# Altium project ARMflash_revC.PrjPcb (part 4 of 4)

## Sheet Pg16_PSU.SchDoc: POWER SUPPLY
size A2; DrawnBy: RvS; DocumentNumber: 16; Revision: C2; SheetNumber: 16; SheetTotal: 16; DocumentName: Power Supply; ProjectName: ARMflash Mini
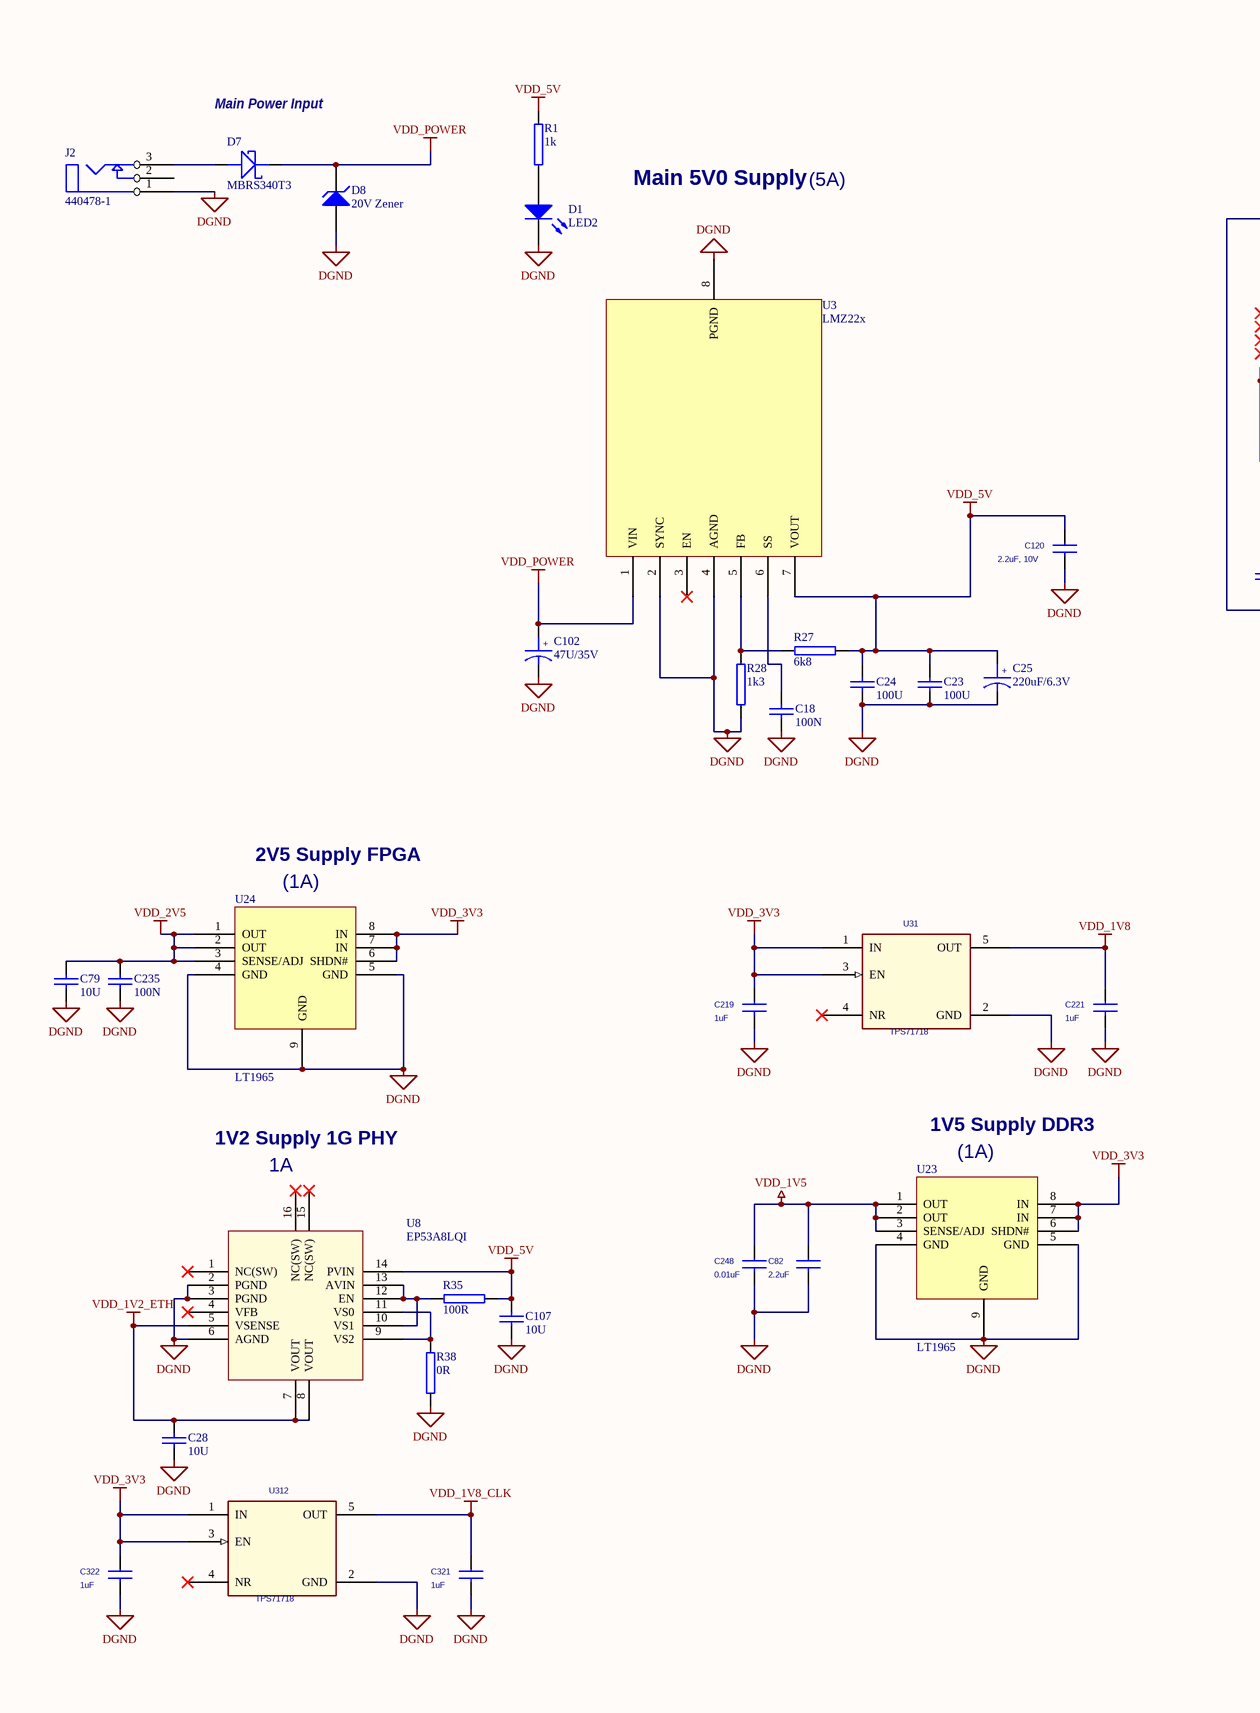
[diagram p19: Pg16_PSU.SchDoc, left]
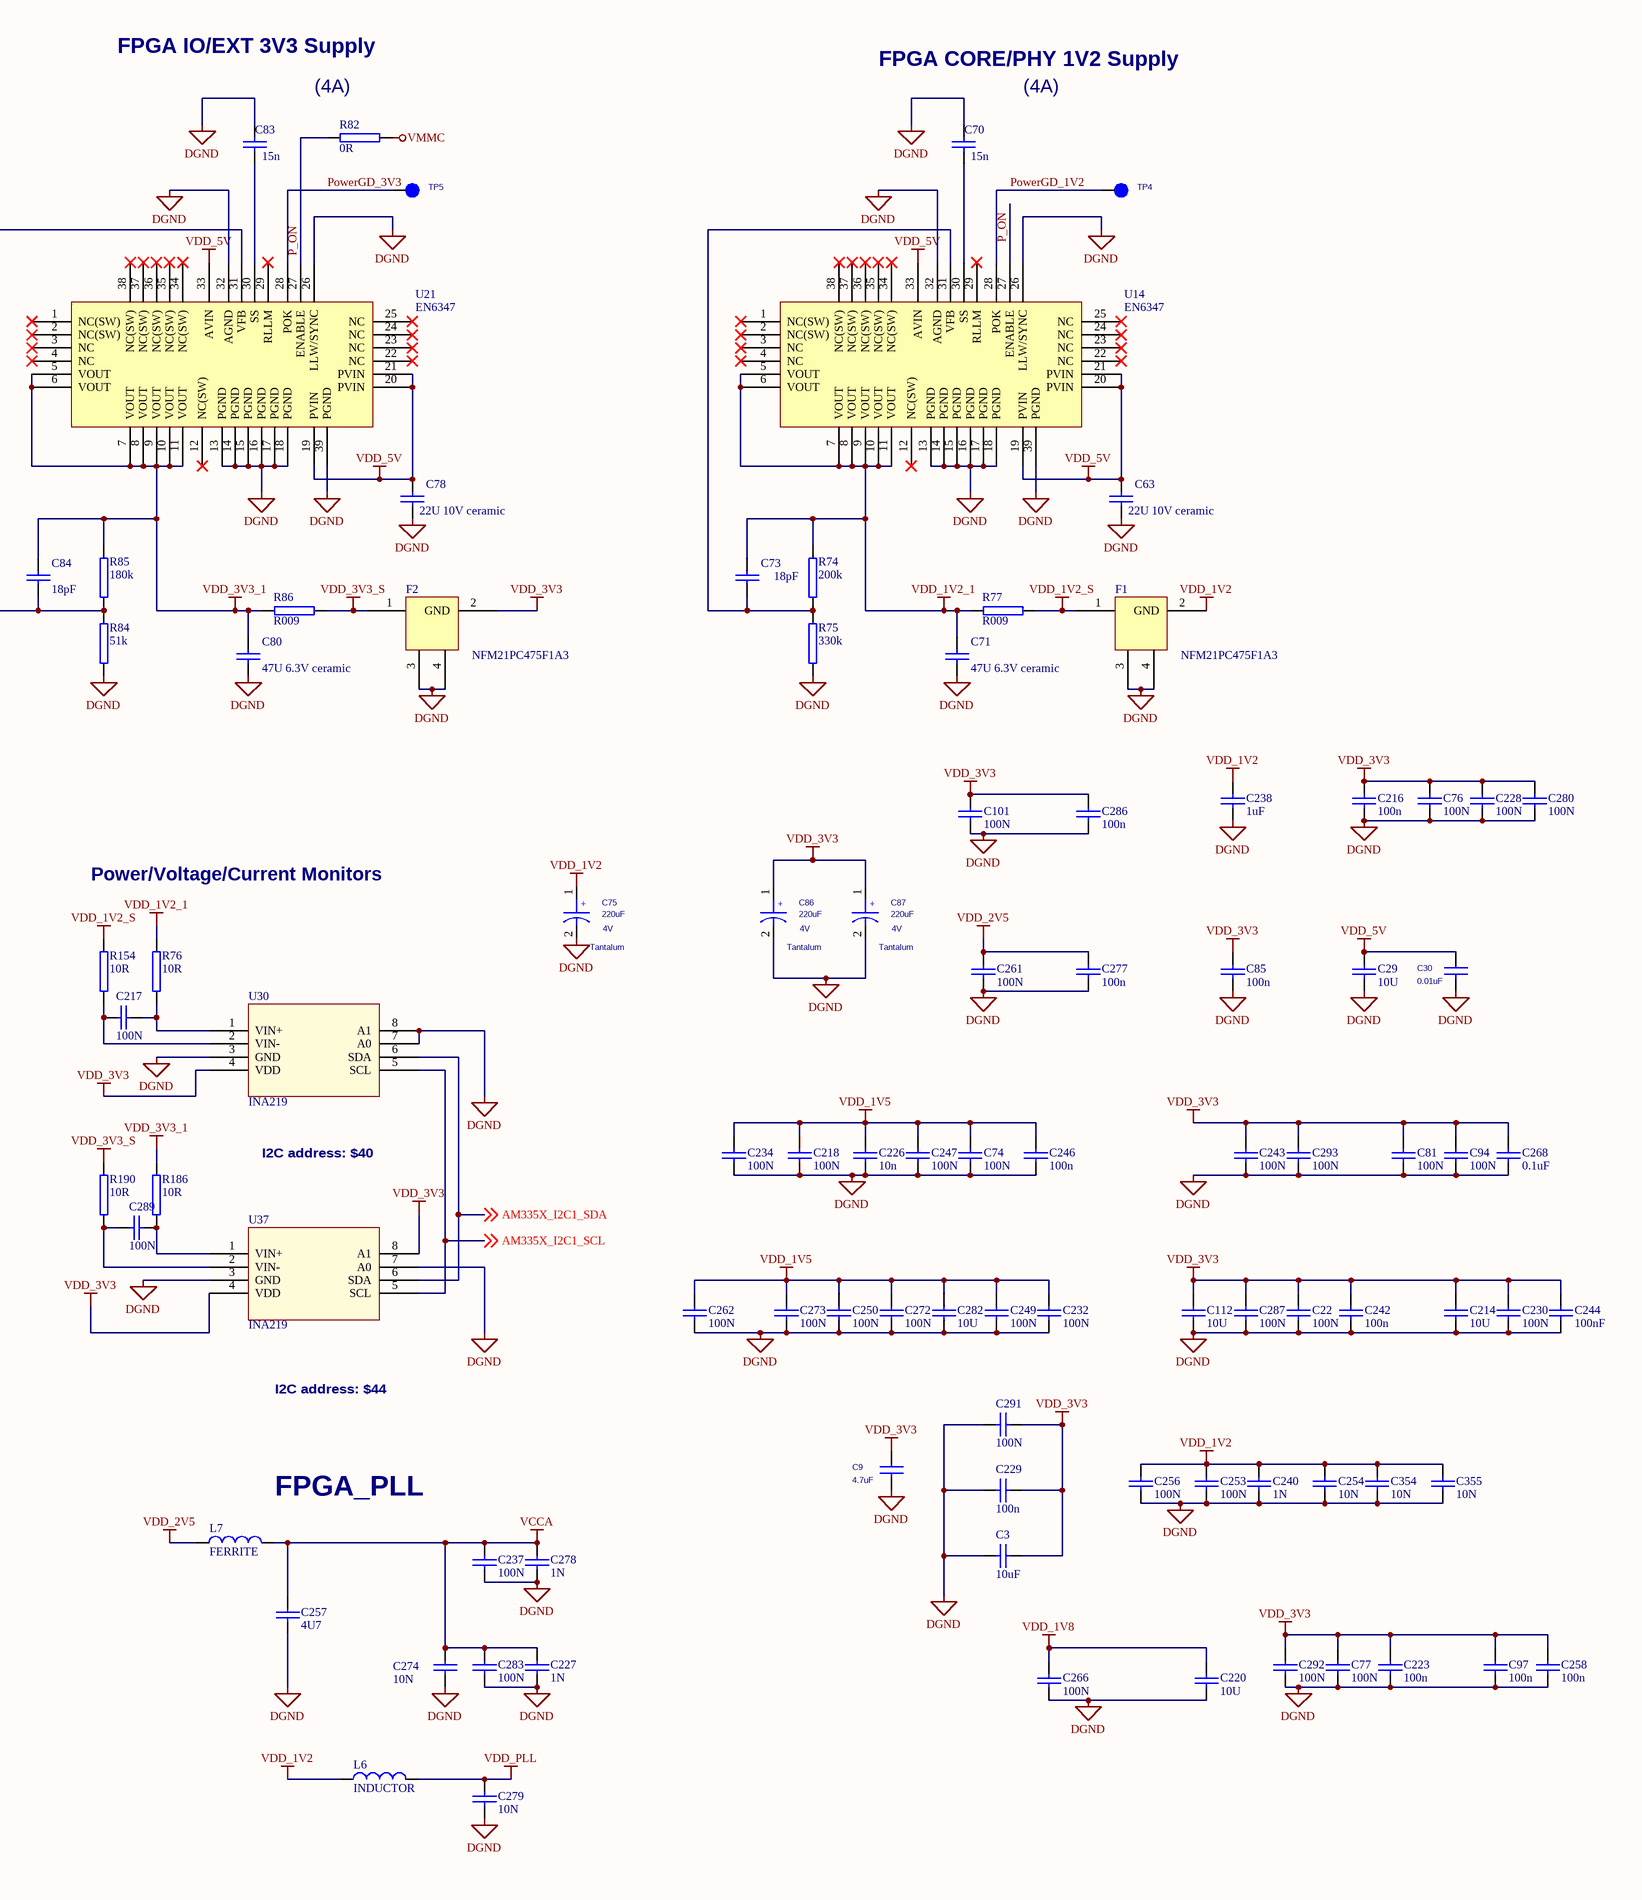
[diagram p20: Pg16_PSU.SchDoc, right]

### Parts
(Parts that share a designator on the sheet are numbered #1, #2 ... from top to bottom, then left to right.)
?#16  (no value)  (graphical)
C3  10uF  [SC0603]
C9  4.7uF  [SM-7351-CAP-0603]
C18  100N  [sc0402]
C22  100N  [0603]
C23  100U  [1206]
C24  100U  [1206]
C25  220uF/6.3V  [CASED]
C28  10U  [SC0603]
C29  10U  [0805]
C30  0.01uF  [SM-7351-CAP-0402]
C63  22U 10V ceramic  [1206]
C70  15n  [sc0402]
C71  47U 6.3V ceramic  [1206]
C73  18pF  [sc0402]
C74  100N  [0603]
C75  220uF  Working Voltage: 4V  Dielectric: Tantalum  [1210]
C76  100N  [sc0402]
C77  100N  [0603]
C78  22U 10V ceramic  [1206]
C79  10U  [sc0603]
C80  47U 6.3V ceramic  [1206]
C81  100N  [0603]
C82  2.2uF  [SM-7351-CAP-0805]
C83  15n  [sc0402]
C84  18pF  [sc0402]
C85  100n  [0603]
C86  220uF  Working Voltage: 4V  Dielectric: Tantalum  [1210]
C87  220uF  Working Voltage: 4V  Dielectric: Tantalum  [1210]
C94  100N  [0603]
C97  100n  [0603]
C101  100N  [0603]
C102  47U/35V  [CASED]
C107  10U  [SC0603]
C112  10U  [SC0603]
C120  2.2uF, 10V  [SM-7351-CAP-0402]
C214  10U  [0603]
C216  100n  [0603]
C217  100N  [sc0402]
C218  100N  [0603]
C219  1uF  [SM-7351-CAP-0402]
C220  10U  [sc0603]
C221  1uF  [SM-7351-CAP-0402]
C223  100n  [0603]
C226  10n  [0603]
C227  1N  [sc0402]
C228  100N  [0603]
C229  100n  [0603]
C230  100N  [0603]
C232  100N  [0603]
C234  100N  [SM-7351-CAP-0402]
C235  100N  [sc0402]
C237  100N  [sc0402]
C238  1uF  [sc0402]
C240  1N  [SM-7351-CAP-0402]
C242  100n  [0603]
C243  100N  [0603]
C244  100nF  [0603]
C246  100n  [SM-7351-CAP-0402]
C247  100N  [SM-7351-CAP-0402]
C248  0.01uF  [SM-7351-CAP-0402]
C249  100N  [0603]
C250  100N  [0603]
C253  100N  [SM-7351-CAP-0402]
C254  10N  [SM-7351-CAP-0402]
C256  100N  [SM-7351-CAP-0402]
C257  4U7  [0603]
C258  100n  [0603]
C261  100N  [sc0402]
C262  100N  [sc0402]
C266  100N  [sc0402]
C268  0.1uF  [sc0402]
C272  100N  [0603]
C273  100N  [sc0402]
C274  10N  [SC0603]
C277  100n  [0603]
C278  1N  [sc0402]
C279  10N  [SM-7351-CAP-0402]
C280  100N  [0603]
C282  10U  [sc0603]
C283  100N  [sc0402]
C286  100n  [0603]
C287  100N  [0603]
C289  100N  [sc0402]
C291  100N  [sc0402]
C292  100N  [0603]
C293  100N  [0603]
C321  1uF  [SM-7351-CAP-0402]
C322  1uF  [SM-7351-CAP-0402]
C354  10N  [SM-7351-CAP-0402]
C355  10N  [SM-7351-CAP-0402]
D1  LED2  [0603]
D7  MBRS340T3  [SMC]
D8  20V Zener  [SMB]
F1  NFM21PC475F1A3  [EM chip filter 0805]
F2  NFM21PC475F1A3  [EM chip filter 0805]
J2  440478-1  [CON_POWER]
L6  INDUCTOR  [sc0603]
L7  FERRITE  [SC0603]
R1  1k  [0603]
R27  6k8  [sc0402]
R28  1k3  [sc0402]
R35  100R  [sc0402]
R38  0R  [sc0402]
R74  200k  [sc0402]
R75  330k  [sc0402]
R76  10R  [sc0402]
R77  R009  [1206]
R82  0R  [sc0402]
R84  51k  [sc0402]
R85  180k  [sc0402]
R86  R009  [1206]
R154  10R  [sc0402]
R186  10R  [sc0402]
R190  10R  [sc0402]
TP4  TP1mm  [tp_smd1mmcircle]  (value not drawn)
TP5  TP1mm  [tp_smd1mmcircle]  (value not drawn)
U3  LMZ22x  [TZA07A]
U8  EP53A8LQI  [LCC 16pin 3x3 mm]
U14  EN6347  [EN6347QI - DFN]
U21  EN6347  [EN6347QI - DFN]
U23  LT1965  [DD package]
U24  LT1965  [DD package]
U30  INA219  [SOT23-8]
U31  TPS71718  [smdsc70-5]
U37  INA219  [SOT23-8]
U312  TPS71718  [smdsc70-5]

### Nets
DGND: C3.1 C9.2 C18.2 C22.2 C23.2 C24.2 C25.2 C28.2 C29.2 C30.2 C63.1 C70.1 C71.1 C74.2 C75.2 C76.2 C77.2 C78.1 C79.2 C80.1 C81.2 C82.2 C83.1 C85.2 C86.2 C87.2 C94.2 C97.2 C101.2 C102.2 C107.2 C112.2 C120.2 C214.2 C216.2 C218.2 C219.2 C220.2 C221.2 C223.2 C226.2 C227.2 C228.2 C229.1 C230.2 C232.2 C234.2 C235.2 C237.2 C238.2 C240.2 C242.2 C243.2 C244.2 C246.2 C247.2 C248.2 C249.2 C250.2 C253.2 C254.2 C256.2 C257.2 C258.2 C261.2 C262.2 C266.2 C268.2 C272.2 C273.2 C274.1 C277.2 C278.2 C279.1 C280.2 C282.2 C283.2 C286.2 C287.2 C291.1 C292.2 C293.2 C321.2 C322.2 C354.2 C355.2 D1.2(K) D8.1(A) F1.3 F1.4 F2.3 F2.4 J2.1 R28.2 R38.2 R75.1 R84.1 U3.2(SYNC) U3.4(AGND) U3.8(PGND) U8.2(PGND) U8.3(PGND) U8.6(AGND) U14.13(PGND) U14.14(PGND) U14.15(PGND) U14.16(PGND) U14.17(PGND) U14.18(PGND) U14.26(LLW/SYNC) U14.32(AGND) U14.39(PGND) U21.13(PGND) U21.14(PGND) U21.15(PGND) U21.16(PGND) U21.17(PGND) U21.18(PGND) U21.26(LLW/SYNC) U21.32(AGND) U21.39(PGND) U23.4(GND) U23.5(GND) U23.9(GND) U24.4(GND) U24.5(GND) U24.9(GND) U30.3(GND) U30.7(A0) U30.8(A1) U31.2(GND) U37.3(GND) U37.7(A0) U312.2(GND)
VCCA: C227.1 C237.1 C257.1 C274.2 C278.1 C283.1 L7.1
VDD_1V2: C75.1 C238.1 C240.1 C253.1 C254.1 C256.1 C354.1 C355.1 F1.2(GND) L6.2
VDD_1V2_1: C71.2 C73.1 R74.2 R76.1 R77.1 U14.5(VOUT) U14.6(VOUT) U14.7(VOUT) U14.8(VOUT) U14.9(VOUT) U14.10(VOUT) U14.11(VOUT)
VDD_1V2_ETH: C28.1 U8.5(VSENSE) U8.7(VOUT) U8.8(VOUT)
VDD_1V2_S: F1.1 R77.2 R154.1
VDD_1V5: C74.1 C82.1 C218.1 C226.1 C232.1 C234.1 C246.1 C247.1 C248.1 C249.1 C250.1 C262.1 C272.1 C273.1 C282.1 U23.1(OUT) U23.2(OUT) U23.3(SENSE/ADJ)
VDD_1V8: C220.1 C221.1 C266.1 U31.5(OUT)
VDD_1V8_CLK: C321.1 U312.5(OUT)
VDD_2V5: C79.1 C235.1 C261.1 C277.1 L7.2 U24.1(OUT) U24.2(OUT) U24.3(SENSE/ADJ)
VDD_3V3: C3.2 C9.1 C22.1 C76.1 C77.1 C81.1 C85.1 C86.1 C87.1 C94.1 C97.1 C101.1 C112.1 C214.1 C216.1 C219.1 C223.1 C228.1 C229.2 C230.1 C242.1 C243.1 C244.1 C258.1 C268.1 C280.1 C286.1 C287.1 C291.2 C292.1 C293.1 C322.1 F2.2(GND) U23.6(SHDN#) U23.7(IN) U23.8(IN) U24.6(SHDN#) U24.7(IN) U24.8(IN) U30.4(VDD) U31.1(IN) U31.3(EN) U37.4(VDD) U37.8(A1) U312.1(IN) U312.3(EN)  [project net VDD]
VDD_3V3_1: C80.2 C84.1 R85.2 R86.1 R186.1 U21.5(VOUT) U21.6(VOUT) U21.7(VOUT) U21.8(VOUT) U21.9(VOUT) U21.10(VOUT) U21.11(VOUT)
VDD_3V3_S: F2.1 R86.2 R190.1
VDD_5V: C23.1 C24.1 C25.1 C29.1 C30.1 C63.2 C78.2 C107.1 C120.1 R1.2 R27.1 R35.1 U3.7(VOUT) U8.14(PVIN) U14.19(PVIN) U14.20(PVIN) U14.21(PVIN) U14.33(AVIN) U21.19(PVIN) U21.20(PVIN) U21.21(PVIN) U21.33(AVIN)
VDD_PLL: C279.2 L6.1
VDD_POWER: C102.1 D7.2(CATHODE) D8.2(K) U3.1(VIN)
VMMC: R82.1
AM335X_I2C1_SCL: U30.5(SCL) U37.5(SCL) ; off-sheet AM335X_I2C1_SCL  [project net SCL]
AM335X_I2C1_SDA: U30.6(SDA) U37.6(SDA) ; off-sheet AM335X_I2C1_SDA  [project net SDA]
P_ON: R82.2 U14.27(ENABLE) U21.27(ENABLE)
PowerGD_1V2: TP4.1 U14.28(POK)
PowerGD_3V3: TP5.1 U21.28(POK)
NetC18_1: C18.1 U3.6(SS)
NetC70_2: C70.2 U14.30(SS)
NetC73_2: C73.2 R74.1 R75.2 U14.31(VFB)
NetC83_2: C83.2 U21.30(SS)
NetC84_2: C84.2 R84.2 R85.1 U21.31(VFB)
NetC217_1: C217.1 R154.2 U30.2(VIN-)
NetC217_2: C217.2 R76.2 U30.1(VIN+)
NetC289_1: C289.1 R190.2 U37.2(VIN-)
NetC289_2: C289.2 R186.2 U37.1(VIN+)
NetD1_1: D1.1(A) R1.1
NetD7_1: D7.1(ANODE) J2.3
NetR27_2: R27.2 R28.1 U3.5(FB)
NetR35_2: R35.2 U8.10(VS1) U8.12(EN) U8.13(AVIN)
NetR38_1: R38.1 U8.9(VS2) U8.11(VS0)

Not connected (* = marked no-connect by the designer): J2 2; U3 3(EN)*; U8 1(NC(SW))* 4(VFB)* 15(NC(SW))* 16(NC(SW))*; U14 1(NC(SW))* 2(NC(SW))* 3(NC)* 4(NC)* 12(NC(SW))* 22(NC)* 23(NC)* 24(NC)* 25(NC)* 29(RLLM)* 34(NC(SW))* 35(NC(SW))* 36(NC(SW))* 37(NC(SW))* 38(NC(SW))*; U21 1(NC(SW))* 2(NC(SW))* 3(NC)* 4(NC)* 12(NC(SW))* 22(NC)* 23(NC)* 24(NC)* 25(NC)* 29(RLLM)* 34(NC(SW))* 35(NC(SW))* 36(NC(SW))* 37(NC(SW))* 38(NC(SW))*; U31 4(NR)*; U312 4(NR)*

### Notes on the sheet
- FPGA IO/EXT 3V3 Supply
- FPGA CORE/PHY 1V2 Supply
- Main Power Input
- (near R82) (4A)
- (4A)
- Main 5V0 Supply
- (5A)
- 2V5 Supply FPGA
- (near U24) (1A)
- Power/Voltage/Current Monitors
- 1V5 Supply DDR3
- 1V2 Supply 1G PHY
- 1A
- (near U23) (1A)
- I2C address: $40
- I2C address: $44
- (near L7) FPGA_PLL
- Embedded Vision Systems Group
- Title
- School of Electrical and Electronic Engineering
- Date:
- Size
- Document Number
- Sheet
- of
- Rev
- (in symbol CAP POL) +
- (in symbol CAP_SMD_POL) +

### Library data of the parts
?#16 = Title Block Address(1): UoM title block
C3 C18 C22-C24 C28 C29 C74 C76 C77 C79 C81 C85 C94 C97 C101 C107 C112 C214 C216-C218 C220 C223 C226-C230 C232 C234 C235 C237 C238 C240 C242-C244 C246 C247 C249 C250 C253 C254 C256-C258 C261 C262 C266 C268 C272-C274 C277-C280 C282 C283 C286 C287 C289 C291-C293 C354 C355 = CAP: NON-POLARISED CAP
C9 = 4.7uFCapacitor16V10%0603: TIIntPartnumber: 1C0103; MfrNum: EMK107ABJ475KA-T; Mfr: Taiyo Yuden; PartName: 4.7uF16V10%SMD0603; Cost10K: 0.00590; Cost100: 0.0198; Vendor: Digikey; DescriptiveText: Capacitor Ceramic 4.7uF 16V 10% 0603
C25 C102 = CAP POL: POLARISED CAPACITOR
C30 C248 = 0.01uFCapacitor16V10%0402_Dup1: Mfr: Panasonic; PartName: 0.01uF16V10%SMD0402; MfrNum: ECJ-0YB1C103K; TIIntPartnumber: 1C0012; PN: 0402YC103KAT2A; TN: 207-0054-000; Vendor: Digikey; Cost100: 0.00; Cost10K: 0.015; DescriptiveText: Capacitor 0.01uF 16V 10% 0402
C63 C70 C71 C73 C78 C80 C83 C84 = CAP: NON-POLARISED CAP; Part Field 1: 1; Part Field 10: 1000u; Part Field 2: 0; Part Field 3: 0; Part Field 4: 0; Part Field 5: 1; Part Field 6: 1000K; Part Field 7: 1u; Part Field 8: 1u; Part Field 9: 500u
C75 C86 C87 = CAP_SMD_POL: CAP - TANTALUM, 330UF, 10%, 4V, 700MOHM ESR, 6032-28; MFR_LIFECYCLE: Active; Manufacturer: Kemet Corporation; Manufacturer Part Num: T495C337K004ATE700; PART_SUBCLASS: CAPACITORS; Tolerance: +/-10%; Num Pins: 2; Item Num: P03-16152R; RoHS Compliant: RoHS Compliant; Lead Free Status: Lead Free; RATED_VOLTAGE: 4V; CAPACITANCE: 330uF; AGILE_LINK: http://sj-agile9app/Agile/PLMServlet?action=OpenEmailObject&classid=10000&objid=259660590; LIFECYCLE_PHASE: Preliminary
C82 = 2.2uF16V10%SMD0805: Capacitor 2.2uF 16V 10% 0805; TIIntPartnumber: 1C0097; MfrNum: C0805C225K4RACTU; Mfr: Kemet; Cost10K: 0.3592; Cost100: 0.5895; Vendor: Digikey; DescriptiveText: Capacitor 2.2uF 16V 10% 0805; PartName: 2.2uF16V10%SMD0805; Descriptive_Text: Capacitor 2.2uF 16V 10% 0805
C120 = 2.2uFCapacitor10V20%smd0402: TIIntPartnumber: 1C0123; MfrNum: LMK105BJ225MV-F; Mfr: Taiyo Yuden; PartName: 2.2uF10V20%SMD0402; DescriptiveText: Capacitor 2.2uF 10V 20% Ceramic 0402; Cost10K: 0.xx; Vendor: Digikey; TN: 207-0054-000; Cost100: 0.xx; PN: -
C219 C221 C321 C322 = 1uFCapacitor10V10%0402: TIIntPartnumber: 1C0084; MfrNum: 0402ZD105KAT2A; Mfr: AVX; PartName: 1uF10V10%0402; DescriptiveText: Capacitor 1uF 10V Ceramic 10% 0402; Cost10K: 0.201; Cost100: 0.336; Vendor: Digikey
D1 = LED2: Typical RED, GREEN, YELLOW, AMBER GaAs LED; Published: 8-Jun-2000; LatestRevisionDate: 17-Jul-2002; LatestRevisionNote: Re-released for DXP Platform.; PackageReference: 3.2X1.6X1.1; Publisher: Altium Limited; PackageVersion: Feb-2002
D7 = MBRS340T3: SCHOTTKY DIODE
D8 = D Zener: Zener Diode; Published: 8-Jun-2000; LatestRevisionDate: 17-Jul-2002; LatestRevisionNote: Re-released for DXP Platform.; PackageReference: DIODE-0.7; Publisher: Altium Limited
F1 F2 = NFM41PC204F1H3: 3 terminal feedthough filter capacitor; Farnell Order Code: 1686512
J2 = CON_POWER: 2.1mm power connector
L7 = INDUCTOR
R1 R27 R28 R76 R154 R186 R190 = RES: RESISTOR
R35 R38 R74 R75 R82 R84 R85 = RES: RESISTOR; Part Field 1: 1; Part Field 10: 1000u; Part Field 2: 0; Part Field 3: 0; Part Field 4: 0; Part Field 5: 1; Part Field 6: 1000K; Part Field 7: 1u; Part Field 8: 1u; Part Field 9: 500u
R77 R86 = RES: Resistor
TP4 TP5 = Testpoint_SMD1mmCircle: Testpoint SMD 1mm circle pad; TIIntPartnumber: 2H0046; Cost10K: 0.00; Cost100: 0; Descriptive_Text: Testpoint SMD 1mm circle pad; Vendor: N/A; MfrNum: N/A; Mfr: N/A; PartName: TestpointSMD1mmCircle; DescriptiveText: Testpoint SMD 1mm circle pad
U3 = LMZ22x: Power Module
U8 = EP53A8xQI
U14 U21 = EN6347QI: 4A PSU power module
U23 U24 = LT1965: LDO regulator adjustable
U30 U37 = INA219: Current/Power Monitor I2C
U31 U312 = TPS71718: Low Dropout 1.8V 150mA Linear Regulator; Mfr: TI; MfrNum: TPS71718DCK; TIIntPartnumber: 1A0262; Vendor: Digikey; Cost100: 1.21; Cost10K: 0.7560; DescriptiveText: Low Dropout 1.8V 150mA Linear Regulator; PartName: TPS71718; Descriptive_Text: Low Dropout 1.8V 150mA Linear Regulator

## Nets that join several sheets
AM335X_USB1_VBUS: Pg03_ AM335X Section 2  (C59.1 D6.1 U10.T18), Pg11_ USB1 (7 pins)
DGND: Pg02_ AM335X Section 1  (8 pins), Pg03_ AM335X Section 2  (19 pins), Pg04_ AM335X Section 3  (115 pins), Pg05_ Platform_Power (34 pins), Pg06_ SysBoot_LEDS_Mech (41 pins), Pg07_ DDR3_Memory (52 pins), Pg08_HDMI (J6.11 J6.12 J6.13 J6.14), Pg09_1G_b (32 pins), Pg10_ NAND_SDMMC Interface (13 pins), Pg11_ USB1 (10 pins), Pg12_USB_UART (23 pins), Pg13_FPGA_Connectors (43 pins), Pg14_FPGA_DDR3 (45 pins), Pg15_FPGA_5CGX (136 pins), Pg16_PSU (134 pins)
Earth: Pg09_1G_b (C90.1 J1.11 J1.12 R89.2), Pg10_ NAND_SDMMC Interface (J9.11 J9.12 J9.13 J9.14), Pg11_ USB1 (8 pins), Pg12_USB_UART (J4.6 J4.7 J4.8 J4.9)
GND_OSC0: Pg02_ AM335X Section 1  (C65.1 C66.1 R116.1 U10.V11), Pg04_ AM335X Section 3  (C202.2)
GNDA_ADC: Pg03_ AM335X Section 2  (7 pins), Pg04_ AM335X Section 3  (FB41.1 U10.E8)
VADC: Pg03_ AM335X Section 2  (C2032.1 R421.1), Pg04_ AM335X Section 3  (FB40.1 U10.D8)
VAUX1: Pg04_ AM335X Section 3  (C196.1 C197.1 U10.N16 U10.R16), Pg05_ Platform_Power (C56.1 U12.46)
VAUX2: Pg04_ AM335X Section 3  (FB8.2), Pg05_ Platform_Power (C57.1 U12.48)
VAUX33: Pg05_ Platform_Power (C53.1 R55.1 R115.2 U12.4), Pg07_ DDR3_Memory (C62.1)
VCCA: Pg15_FPGA_5CGX (6 pins), Pg16_PSU (7 pins)
VCCIO_B4A: Pg13_FPGA_Connectors (U32.1 U32.4), Pg15_FPGA_5CGX (10 pins)
VDAC: Pg04_ AM335X Section 3  (C45.1 C126.1 FB4.2), Pg05_ Platform_Power (C42.1 U12.22)
VDD: Pg06_ SysBoot_LEDS_Mech (30 pins), Pg07_ DDR3_Memory (R13.1 R1401.2 U6.10), Pg08_HDMI (R71.1), Pg09_1G_b (16 pins), Pg12_USB_UART (8 pins), Pg13_FPGA_Connectors (11 pins), Pg15_FPGA_5CGX (43 pins), Pg16_PSU (46 pins)
VDD_1V2: Pg15_FPGA_5CGX (29 pins), Pg16_PSU (10 pins)
VDD_1V2_ETH: Pg09_1G_b (14 pins), Pg16_PSU (C28.1 U8.5 U8.7 U8.8)
VDD_1V5: Pg14_FPGA_DDR3 (25 pins), Pg15_FPGA_5CGX (10 pins), Pg16_PSU (18 pins)
VDD_1V8: Pg15_FPGA_5CGX (R164.2), Pg16_PSU (C220.1 C221.1 C266.1 U31.5)
VDD_1V8_CLK: Pg14_FPGA_DDR3 (U34.1 U34.4), Pg16_PSU (C321.1 U312.5)
VDD_2V5: Pg15_FPGA_5CGX (13 pins), Pg16_PSU (8 pins)
VDD_5V: Pg05_ Platform_Power (21 pins), Pg11_ USB1 (U26.2 U26.3), Pg12_USB_UART (J5.21 J5.22), Pg16_PSU (22 pins)
VDD_CORE: Pg04_ AM335X Section 3  (29 pins), Pg05_ Platform_Power (C68.1 L4.2 U12.44)
VDD_MPU: Pg04_ AM335X Section 3  (13 pins), Pg05_ Platform_Power (C46.1 L3.2 R65.1)
VDD_PLL: Pg15_FPGA_5CGX (6 pins), Pg16_PSU (C279.2 L6.1)
VDD_POWER: Pg13_FPGA_Connectors (7 pins), Pg16_PSU (C102.1 D7.2 D8.2 U3.1)
VDDS_DDR: Pg04_ AM335X Section 3  (26 pins), Pg05_ Platform_Power (C125.1 L2.2 U12.16), Pg07_ DDR3_Memory (38 pins)
VDDS_RTC: Pg02_ AM335X Section 1  (6 pins), Pg04_ AM335X Section 3  (C198.1 U10.D7), Pg05_ Platform_Power (C40.1 R52.1 R69.2 R113.1)
VDDSHV6: Pg02_ AM335X Section 1  (R44.2 R441.2), Pg03_ AM335X Section 2  (15 pins), Pg04_ AM335X Section 3  (20 pins), Pg10_ NAND_SDMMC Interface (9 pins), Pg11_ USB1 (R92.2), Pg15_FPGA_5CGX (R73.2 R137.2 U15.1)
VDDSHV1234: Pg04_ AM335X Section 3  (16 pins), Pg10_ NAND_SDMMC Interface (12 pins)
VDIG2: Pg04_ AM335X Section 3  (12 pins), Pg05_ Platform_Power (C49.1 U12.5)
VMMC: Pg04_ AM335X Section 3  (6 pins), Pg05_ Platform_Power (C52.1 U12.2), Pg16_PSU (R82.1)
VPLL: Pg04_ AM335X Section 3  (FB40.2), Pg05_ Platform_Power (C41.1 U12.24)
ACC_INT1: Pg03_ AM335X Section 2  (R132.1 U10.E17), Pg06_ SysBoot_LEDS_Mech (U33.11 U36.7 U38.12)
ACC_INT2: Pg03_ AM335X Section 2  (R133.1 U10.E18), Pg06_ SysBoot_LEDS_Mech (R159.2 R165.2 U36.6)
AIN0: Pg03_ AM335X Section 2  (U10.B6), Pg12_USB_UART (J5.26)
AIN1: Pg03_ AM335X Section 2  (U10.C7), Pg12_USB_UART (J5.23)
AIN2: Pg03_ AM335X Section 2  (U10.B7), Pg12_USB_UART (J5.25)
AIN3: Pg03_ AM335X Section 2  (U10.A7), Pg12_USB_UART (J5.24)
AM335X_BOOT_D2: Pg03_ AM335X Section 2  (R147.1), Pg15_FPGA_5CGX (S2.5)
AM335X_EXT_WAKEUP: Pg03_ AM335X Section 2  (R42.2), Pg12_USB_UART (J5.30)
AM335x_EXTINT: Pg02_ AM335X Section 1  (R441.1 U10.B18), Pg06_ SysBoot_LEDS_Mech (C131.1 R53.1), Pg12_USB_UART (J5.31), Pg15_FPGA_5CGX (U19.K15)
AM335X_GPIO_LED1: Pg03_ AM335X Section 2  (U10.H17), Pg06_ SysBoot_LEDS_Mech (Q2.G R97.2)
AM335X_I2C0_SCL: Pg03_ AM335X Section 2  (R103.1 U10.C16), Pg05_ Platform_Power (R61.2 R62.2), Pg06_ SysBoot_LEDS_Mech (U20.6 U28.6)
AM335X_I2C0_SDA: Pg03_ AM335X Section 2  (R104.1 U10.C17), Pg05_ Platform_Power (R63.2 R66.2), Pg06_ SysBoot_LEDS_Mech (U20.5 U28.5)
AM335X_LCD_DATA0: Pg03_ AM335X Section 2  (R138.1 R143.2 U10.R1), Pg08_HDMI (J6.23)
AM335X_LCD_DATA1: Pg03_ AM335X Section 2  (R139.1 R144.2 U10.R2), Pg08_HDMI (J6.25)
AM335X_LCD_DATA2: Pg03_ AM335X Section 2  (R141.1 R147.2 U10.R3), Pg08_HDMI (J6.8)
AM335X_LCD_DATA3: Pg03_ AM335X Section 2  (R146.1 R148.2 U10.R4), Pg08_HDMI (J6.7)
AM335X_LCD_DATA4: Pg03_ AM335X Section 2  (R140.1 R145.2 U10.T1), Pg08_HDMI (J6.24)
AM335X_LCD_DATA5: Pg03_ AM335X Section 2  (R142.1 R149.2 U10.T2), Pg08_HDMI (J6.27)
AM335X_LCD_DATA6: Pg03_ AM335X Section 2  (R150.2 U10.T3), Pg08_HDMI (J6.6)
AM335X_LCD_DATA7: Pg03_ AM335X Section 2  (R151.2 U10.T4), Pg08_HDMI (J6.5)
AM335X_LCD_DATA8: Pg03_ AM335X Section 2  (R121.2 R134.1 U10.U1), Pg08_HDMI (J6.26)
AM335X_LCD_DATA9: Pg03_ AM335X Section 2  (R122.2 R135.1 U10.U2), Pg08_HDMI (J6.29)
AM335X_LCD_DATA10: Pg03_ AM335X Section 2  (R125.2 U10.U3), Pg08_HDMI (J6.31)
AM335X_LCD_DATA11: Pg03_ AM335X Section 2  (R152.2 U10.U4), Pg08_HDMI (J6.3)
AM335X_LCD_DATA12: Pg03_ AM335X Section 2  (R123.2 U10.V2), Pg08_HDMI (J6.28)
AM335X_LCD_DATA13: Pg03_ AM335X Section 2  (R124.2 U10.V3), Pg08_HDMI (J6.30)
AM335X_LCD_DATA14: Pg03_ AM335X Section 2  (R136.1 U10.V4), Pg08_HDMI (J6.32)
AM335X_LCD_DATA15: Pg03_ AM335X Section 2  (R153.2 U10.T5), Pg08_HDMI (J6.4)
AM335X_MMC0_CLK: Pg02_ AM335X Section 1  (R64.1), Pg10_ NAND_SDMMC Interface (J9.5)
AM335X_MMC0_CMD: Pg02_ AM335X Section 1  (U10.G18), Pg10_ NAND_SDMMC Interface (J9.3 R59.1)
AM335X_MMC0_D0: Pg02_ AM335X Section 1  (U10.G16), Pg10_ NAND_SDMMC Interface (J9.7 R3.1)
AM335X_MMC0_D1: Pg02_ AM335X Section 1  (U10.G15), Pg10_ NAND_SDMMC Interface (J9.8 R2.1)
AM335X_MMC0_D2: Pg02_ AM335X Section 1  (U10.F18), Pg10_ NAND_SDMMC Interface (J9.1 R57.1)
AM335X_MMC0_D3: Pg02_ AM335X Section 1  (U10.F17), Pg10_ NAND_SDMMC Interface (J9.2 R58.1)
AM335X_MMC_CD: Pg03_ AM335X Section 2  (U10.A14), Pg10_ NAND_SDMMC Interface (R100.1 R1000.1), Pg12_USB_UART (J5.32)
AM335X_RGMII1_RXCLK: Pg03_ AM335X Section 2  (U10.L18), Pg09_1G_b (R24.1 U7.35)
AM335X_RGMII1_RXD0: Pg03_ AM335X Section 2  (U10.M16), Pg09_1G_b (R32.2 U7.32)
AM335X_RGMII1_RXD1: Pg03_ AM335X Section 2  (U10.L15), Pg09_1G_b (R31.2 U7.31)
AM335X_RGMII1_RXD2: Pg03_ AM335X Section 2  (U10.L16), Pg09_1G_b (R30.2 U7.28)
AM335X_RGMII1_RXD3: Pg03_ AM335X Section 2  (U10.L17), Pg09_1G_b (R34.2 U7.27)
AM335X_RGMII1_RXDV: Pg03_ AM335X Section 2  (U10.J17), Pg09_1G_b (R23.1 U7.33)
AM335X_SPI0_CS0: Pg03_ AM335X Section 2  (R101.1 U10.A16), Pg13_FPGA_Connectors (J10.15)
AM335X_SPI0_CS1: Pg03_ AM335X Section 2  (U10.C15), Pg13_FPGA_Connectors (J10.16)
AM335X_SPI0_D0: Pg03_ AM335X Section 2  (U10.B17), Pg13_FPGA_Connectors (J10.18)
AM335X_SPI0_D1: Pg03_ AM335X Section 2  (R51.1 U10.B16), Pg13_FPGA_Connectors (J10.17)
AM335X_SPI0_SCLK: Pg03_ AM335X Section 2  (R49.2), Pg13_FPGA_Connectors (J10.20)
AM335X_UART0_RXD: Pg03_ AM335X Section 2  (U10.E15), Pg12_USB_UART (U5.15)
AM335X_UART0_TXD: Pg03_ AM335X Section 2  (U10.E16), Pg12_USB_UART (U5.2)
AM335X_USB1_DRVVBUS: Pg03_ AM335X Section 2  (U10.F15), Pg11_ USB1 (R107.1 U26.4)
AM335X_XDMA_EVENT_INTR0: Pg02_ AM335X Section 1  (R50.1), Pg15_FPGA_5CGX (U19.L18)
AM335X_XDMA_EVENT_INTR1: Pg02_ AM335X Section 1  (R106.1), Pg15_FPGA_5CGX (U19.H21)
ARM_TCK: Pg03_ AM335X Section 2  (U10.C13), Pg12_USB_UART (J5.19), Pg15_FPGA_5CGX (U15.5 U16.2)
ARM_TDI: Pg03_ AM335X Section 2  (U10.D13), Pg12_USB_UART (J5.20), Pg15_FPGA_5CGX (U15.3)
ARM_TDO: Pg03_ AM335X Section 2  (U10.D12), Pg08_HDMI (J6.18), Pg12_USB_UART (J5.17), Pg15_FPGA_5CGX (U15.4 U17.2)
ARM_TMS: Pg03_ AM335X Section 2  (U10.B12), Pg12_USB_UART (J5.18), Pg15_FPGA_5CGX (U15.2)
DDR_A0: Pg02_ AM335X Section 1  (U10.F3), Pg07_ DDR3_Memory (RP3.7 U11.N3)
DDR_A1: Pg02_ AM335X Section 1  (U10.H1), Pg07_ DDR3_Memory (RP2.5 U11.P7)
DDR_A2: Pg02_ AM335X Section 1  (U10.E4), Pg07_ DDR3_Memory (RP1.5 U11.P3)
DDR_A3: Pg02_ AM335X Section 1  (U10.C3), Pg07_ DDR3_Memory (RP3.4 U11.N2)
DDR_A4: Pg02_ AM335X Section 1  (U10.C2), Pg07_ DDR3_Memory (RP2.7 U11.P8)
DDR_A5: Pg02_ AM335X Section 1  (U10.B1), Pg07_ DDR3_Memory (RP3.3 U11.P2)
DDR_A6: Pg02_ AM335X Section 1  (U10.D5), Pg07_ DDR3_Memory (RP2.8 U11.R8)
DDR_A7: Pg02_ AM335X Section 1  (U10.E2), Pg07_ DDR3_Memory (RP1.8 U11.R2)
DDR_A8: Pg02_ AM335X Section 1  (U10.D4), Pg07_ DDR3_Memory (RP1.1 U11.T8)
DDR_A9: Pg02_ AM335X Section 1  (U10.C1), Pg07_ DDR3_Memory (RP1.6 U11.R3)
DDR_A10: Pg02_ AM335X Section 1  (U10.F4), Pg07_ DDR3_Memory (RP2.3 U11.L7)
DDR_A11: Pg02_ AM335X Section 1  (U10.F2), Pg07_ DDR3_Memory (RP1.3 U11.R7)
DDR_A12: Pg02_ AM335X Section 1  (U10.E3), Pg07_ DDR3_Memory (RP2.4 U11.N7)
DDR_A13: Pg02_ AM335X Section 1  (U10.H3), Pg07_ DDR3_Memory (RP1.7 U11.T3)
DDR_A14: Pg02_ AM335X Section 1  (U10.H4), Pg07_ DDR3_Memory (RP1.2 U11.T7)
DDR_A15: Pg02_ AM335X Section 1  (U10.D3), Pg07_ DDR3_Memory (RP1.4 U11.M7)
DDR_BA0: Pg02_ AM335X Section 1  (U10.C4), Pg07_ DDR3_Memory (RP3.5 U11.M2)
DDR_BA1: Pg02_ AM335X Section 1  (U10.E1), Pg07_ DDR3_Memory (RP2.6 U11.N8)
DDR_BA2: Pg02_ AM335X Section 1  (U10.B3), Pg07_ DDR3_Memory (RP3.8 U11.M3)
DDR_CASn: Pg02_ AM335X Section 1  (U10.F1), Pg07_ DDR3_Memory (RP2.1 U11.K3)
DDR_CKE: Pg02_ AM335X Section 1  (U10.G3), Pg07_ DDR3_Memory (R47.2 U11.K9)
DDR_CLK: Pg02_ AM335X Section 1  (U10.D2), Pg07_ DDR3_Memory (R110.1 U11.J7)
DDR_CLKn: Pg02_ AM335X Section 1  (U10.D1), Pg07_ DDR3_Memory (R111.1 U11.K7)
DDR_CSn: Pg02_ AM335X Section 1  (U10.H2), Pg07_ DDR3_Memory (RP3.2 U11.L2)
DDR_D0: Pg02_ AM335X Section 1  (U10.M3), Pg07_ DDR3_Memory (U11.H8)
DDR_D1: Pg02_ AM335X Section 1  (U10.M4), Pg07_ DDR3_Memory (U11.H7)
DDR_D2: Pg02_ AM335X Section 1  (U10.N1), Pg07_ DDR3_Memory (U11.H3)
DDR_D3: Pg02_ AM335X Section 1  (U10.N2), Pg07_ DDR3_Memory (U11.E3)
DDR_D4: Pg02_ AM335X Section 1  (U10.N3), Pg07_ DDR3_Memory (U11.G2)
DDR_D5: Pg02_ AM335X Section 1  (U10.N4), Pg07_ DDR3_Memory (U11.F2)
DDR_D6: Pg02_ AM335X Section 1  (U10.P3), Pg07_ DDR3_Memory (U11.F7)
DDR_D7: Pg02_ AM335X Section 1  (U10.P4), Pg07_ DDR3_Memory (U11.F8)
DDR_D8: Pg02_ AM335X Section 1  (U10.J1), Pg07_ DDR3_Memory (U11.C3)
DDR_D9: Pg02_ AM335X Section 1  (U10.K1), Pg07_ DDR3_Memory (U11.A3)
DDR_D10: Pg02_ AM335X Section 1  (U10.K2), Pg07_ DDR3_Memory (U11.A2)
DDR_D11: Pg02_ AM335X Section 1  (U10.K3), Pg07_ DDR3_Memory (U11.D7)
DDR_D12: Pg02_ AM335X Section 1  (U10.K4), Pg07_ DDR3_Memory (U11.C2)
DDR_D13: Pg02_ AM335X Section 1  (U10.L3), Pg07_ DDR3_Memory (U11.B8)
DDR_D14: Pg02_ AM335X Section 1  (U10.L4), Pg07_ DDR3_Memory (U11.C8)
DDR_D15: Pg02_ AM335X Section 1  (U10.M1), Pg07_ DDR3_Memory (U11.A7)
DDR_DQM0: Pg02_ AM335X Section 1  (U10.M2), Pg07_ DDR3_Memory (U11.E7)
DDR_DQM1: Pg02_ AM335X Section 1  (U10.J2), Pg07_ DDR3_Memory (U11.D3)
DDR_DQS0: Pg02_ AM335X Section 1  (U10.P1), Pg07_ DDR3_Memory (U11.F3)
DDR_DQS1: Pg02_ AM335X Section 1  (U10.L1), Pg07_ DDR3_Memory (U11.C7)
DDR_DQSN0: Pg02_ AM335X Section 1  (U10.P2), Pg07_ DDR3_Memory (U11.G3)
DDR_DQSN1: Pg02_ AM335X Section 1  (U10.L2), Pg07_ DDR3_Memory (U11.B7)
DDR_ODT: Pg02_ AM335X Section 1  (U10.G1), Pg07_ DDR3_Memory (RP3.1 U11.K1)
DDR_RASn: Pg02_ AM335X Section 1  (U10.G4), Pg07_ DDR3_Memory (RP2.2 U11.J3)
DDR_RESETn: Pg02_ AM335X Section 1  (U10.G2), Pg07_ DDR3_Memory (R39.1 R40.2 U11.T2)
DDR_VREF: Pg02_ AM335X Section 1  (C153.1 U10.J4), Pg07_ DDR3_Memory (8 pins)
DDR_VTT_EN: Pg03_ AM335X Section 2  (R12.2), Pg07_ DDR3_Memory (R14.1 R1401.1 U6.7)
DDR_WEn: Pg02_ AM335X Section 1  (U10.B2), Pg07_ DDR3_Memory (RP3.6 U11.L3)
ENET_GTX_CLK: Pg03_ AM335X Section 2  (U10.K18), Pg09_1G_b (U7.24)
ENET_INTn: Pg03_ AM335X Section 2  (R1321.1), Pg09_1G_b (R11.2 U7.38)
ENET_MDC: Pg03_ AM335X Section 2  (U10.M18), Pg09_1G_b (R22.2 U7.36)
ENET_MDIO: Pg03_ AM335X Section 2  (U10.M17), Pg09_1G_b (R10.2 U7.37)
ENET_RESETn: Pg02_ AM335X Section 1  (R44.1 U10.A10), Pg06_ SysBoot_LEDS_Mech (C95.1 S1.1 S1.3), Pg09_1G_b (U7.42), Pg12_USB_UART (J5.38 R43.2)
ENET_TX_EN: Pg03_ AM335X Section 2  (U10.J16), Pg09_1G_b (U7.25)
ENET_TXD0: Pg03_ AM335X Section 2  (U10.K17), Pg09_1G_b (U7.19)
ENET_TXD1: Pg03_ AM335X Section 2  (U10.K16), Pg09_1G_b (U7.20)
ENET_TXD2: Pg03_ AM335X Section 2  (U10.K15), Pg09_1G_b (U7.21)
ENET_TXD3: Pg03_ AM335X Section 2  (U10.J18), Pg09_1G_b (U7.22)
EXP_PB_POWERON: Pg05_ Platform_Power (C184.1 R112.1 U12.33), Pg12_USB_UART (J5.40)
FPGA_DDR3_VREF: Pg14_FPGA_DDR3 (9 pins), Pg15_FPGA_5CGX (U19.B10 U19.D16)
FPGA_VREF_B3AB: Pg13_FPGA_Connectors (P3.52), Pg15_FPGA_5CGX (U19.AB12 U19.W6)
FPGA_VREF_B4: Pg13_FPGA_Connectors (P3.54), Pg15_FPGA_5CGX (U19.AA14)
GPIO0_29: Pg03_ AM335X Section 2  (R1321.2 U10.H18), Pg12_USB_UART (J5.34)
GPMC_A1: Pg02_ AM335X Section 1  (U10.V14), Pg15_FPGA_5CGX (U19.R20)
GPMC_A2: Pg02_ AM335X Section 1  (U10.U14), Pg15_FPGA_5CGX (U19.T19)
GPMC_A3: Pg02_ AM335X Section 1  (U10.T14), Pg15_FPGA_5CGX (U19.V19)
GPMC_A4: Pg02_ AM335X Section 1  (U10.R14), Pg15_FPGA_5CGX (U19.J19)
GPMC_A5: Pg02_ AM335X Section 1  (U10.V15), Pg15_FPGA_5CGX (U19.T20)
GPMC_A6: Pg02_ AM335X Section 1  (U10.U15), Pg15_FPGA_5CGX (U19.R21)
GPMC_A7: Pg02_ AM335X Section 1  (U10.T15), Pg15_FPGA_5CGX (U19.V20)
GPMC_A8: Pg02_ AM335X Section 1  (U10.V16), Pg15_FPGA_5CGX (U19.U21)
GPMC_A9: Pg02_ AM335X Section 1  (U10.U16), Pg15_FPGA_5CGX (U19.U22)
GPMC_A10: Pg02_ AM335X Section 1  (U10.T16), Pg15_FPGA_5CGX (U19.G21)
GPMC_A11: Pg02_ AM335X Section 1  (U10.V17), Pg15_FPGA_5CGX (U19.G20)
GPMC_ALE: Pg02_ AM335X Section 1  (U10.R7), Pg10_ NAND_SDMMC Interface (R129.2), Pg15_FPGA_5CGX (U19.G17)
GPMC_BE0: Pg02_ AM335X Section 1  (U10.T6), Pg10_ NAND_SDMMC Interface (R128.2)
GPMC_CLK: Pg02_ AM335X Section 1  (U10.U9), Pg15_FPGA_5CGX (U19.L17)
GPMC_D0: Pg02_ AM335X Section 1  (U10.U7), Pg10_ NAND_SDMMC Interface (U13.H4), Pg15_FPGA_5CGX (U19.G18)
GPMC_D1: Pg02_ AM335X Section 1  (U10.V7), Pg10_ NAND_SDMMC Interface (U13.J4), Pg15_FPGA_5CGX (U19.H18)
GPMC_D2: Pg02_ AM335X Section 1  (U10.R8), Pg10_ NAND_SDMMC Interface (U13.K4), Pg15_FPGA_5CGX (U19.E20)
GPMC_D3: Pg02_ AM335X Section 1  (U10.T8), Pg10_ NAND_SDMMC Interface (U13.K5), Pg15_FPGA_5CGX (U19.F20)
GPMC_D4: Pg02_ AM335X Section 1  (U10.U8), Pg10_ NAND_SDMMC Interface (U13.K6), Pg15_FPGA_5CGX (U19.K16)
GPMC_D5: Pg02_ AM335X Section 1  (U10.V8), Pg10_ NAND_SDMMC Interface (U13.J7), Pg15_FPGA_5CGX (U19.J16)
GPMC_D6: Pg02_ AM335X Section 1  (U10.R9), Pg10_ NAND_SDMMC Interface (U13.K7), Pg15_FPGA_5CGX (U19.H19)
GPMC_D7: Pg02_ AM335X Section 1  (U10.T9), Pg10_ NAND_SDMMC Interface (U13.J8), Pg15_FPGA_5CGX (U19.J18)
GPMC_D8: Pg02_ AM335X Section 1  (U10.U10), Pg10_ NAND_SDMMC Interface (U13.H3), Pg15_FPGA_5CGX (U19.T22)
GPMC_D9: Pg02_ AM335X Section 1  (U10.T10), Pg10_ NAND_SDMMC Interface (U13.J3), Pg15_FPGA_5CGX (U19.H20)
GPMC_D10: Pg02_ AM335X Section 1  (U10.T11), Pg10_ NAND_SDMMC Interface (U13.H5), Pg15_FPGA_5CGX (U19.K17)
GPMC_D11: Pg02_ AM335X Section 1  (U10.U12), Pg10_ NAND_SDMMC Interface (U13.J5), Pg15_FPGA_5CGX (U19.T17)
GPMC_D12: Pg02_ AM335X Section 1  (U10.T12), Pg10_ NAND_SDMMC Interface (U13.H6), Pg15_FPGA_5CGX (U19.R17)
GPMC_D13: Pg02_ AM335X Section 1  (U10.R12), Pg10_ NAND_SDMMC Interface (U13.G6), Pg15_FPGA_5CGX (U19.R16)
GPMC_D14: Pg02_ AM335X Section 1  (U10.V13), Pg10_ NAND_SDMMC Interface (U13.H7), Pg15_FPGA_5CGX (U19.R19)
GPMC_D15: Pg02_ AM335X Section 1  (U10.U13), Pg10_ NAND_SDMMC Interface (U13.G7), Pg15_FPGA_5CGX (U19.P19)
GPMC_NCS0: Pg02_ AM335X Section 1  (U10.V6), Pg10_ NAND_SDMMC Interface (R127.2)
GPMC_NCS2: Pg02_ AM335X Section 1  (U10.V9), Pg15_FPGA_5CGX (U19.R22)
GPMC_NCS3: Pg02_ AM335X Section 1  (U10.T13), Pg15_FPGA_5CGX (U19.T18)
GPMC_NOE: Pg02_ AM335X Section 1  (U10.T7), Pg10_ NAND_SDMMC Interface (R126.2), Pg15_FPGA_5CGX (U19.F18)
GPMC_NWE: Pg02_ AM335X Section 1  (U10.U6), Pg10_ NAND_SDMMC Interface (R131.2), Pg15_FPGA_5CGX (U19.F19)
GPMC_NWP: Pg02_ AM335X Section 1  (U10.U17), Pg10_ NAND_SDMMC Interface (R118.2)
GPMC_WAIT0: Pg02_ AM335X Section 1  (U10.T17), Pg10_ NAND_SDMMC Interface (R130.2)
GPMC_WAIT1: Pg02_ AM335X Section 1  (U10.V12), Pg15_FPGA_5CGX (U19.J17)
IOB5B_X0_N: Pg13_FPGA_Connectors (P3.3), Pg15_FPGA_5CGX (U19.N16)
IOB5B_X0_P: Pg13_FPGA_Connectors (P3.1), Pg15_FPGA_5CGX (U19.P16)
IOB5B_X1_N: Pg13_FPGA_Connectors (P3.7), Pg15_FPGA_5CGX (U19.P22)
IOB5B_X1_P: Pg13_FPGA_Connectors (P3.5), Pg15_FPGA_5CGX (U19.P21)
IOB5B_X2_N: Pg13_FPGA_Connectors (P3.19), Pg15_FPGA_5CGX (U19.L20)
IOB5B_X2_P: Pg13_FPGA_Connectors (P3.17), Pg15_FPGA_5CGX (U19.L19)
IOB5B_X3_N: Pg13_FPGA_Connectors (P3.23), Pg15_FPGA_5CGX (U19.J22)
IOB5B_X3_P: Pg13_FPGA_Connectors (P3.21), Pg15_FPGA_5CGX (U19.K22)
IOB5B_X4_N: Pg13_FPGA_Connectors (P3.27), Pg15_FPGA_5CGX (U19.J21)
IOB5B_X4_P: Pg13_FPGA_Connectors (P3.25), Pg15_FPGA_5CGX (U19.K21)
IOB5B_X5_N: Pg13_FPGA_Connectors (P3.31), Pg15_FPGA_5CGX (U19.N18)
IOB5B_X5_P: Pg13_FPGA_Connectors (P3.29), Pg15_FPGA_5CGX (U19.P18)
IOB5B_X6_N: Pg13_FPGA_Connectors (P3.35), Pg15_FPGA_5CGX (U19.M20)
IOB5B_X6_P: Pg13_FPGA_Connectors (P3.33), Pg15_FPGA_5CGX (U19.M21)
IOB5B_X7_N: Pg13_FPGA_Connectors (P3.47), Pg15_FPGA_5CGX (U19.E22)
IOB5B_X7_P: Pg13_FPGA_Connectors (P3.45), Pg15_FPGA_5CGX (U19.F22)
IOB5B_X8_N: Pg13_FPGA_Connectors (P3.51), Pg15_FPGA_5CGX (U19.D22)
IOB5B_X8_P: Pg13_FPGA_Connectors (P3.49), Pg15_FPGA_5CGX (U19.E21)
IOB5B_X9_N: Pg13_FPGA_Connectors (P3.55), Pg15_FPGA_5CGX (U19.L22)
IOB5B_X9_P: Pg13_FPGA_Connectors (P3.53), Pg15_FPGA_5CGX (U19.M22)
IOB5B_X10_N: Pg13_FPGA_Connectors (P3.59), Pg15_FPGA_5CGX (U19.N21)
IOB5B_X10_P: Pg13_FPGA_Connectors (P3.57), Pg15_FPGA_5CGX (U19.N20)
JTAG_EMU0: Pg02_ AM335X Section 1  (U10.C14), Pg12_USB_UART (J5.13 R20.2)
JTAG_EMU1: Pg02_ AM335X Section 1  (U10.B14), Pg12_USB_UART (J5.14 R21.1)
JTAG_TCK: Pg02_ AM335X Section 1  (U10.A12), Pg12_USB_UART (R18.2 R19.2)
JTAG_TDI: Pg02_ AM335X Section 1  (U10.B11), Pg12_USB_UART (J5.7)
JTAG_TDO: Pg02_ AM335X Section 1  (U10.A11), Pg12_USB_UART (J5.3)
JTAG_TMS: Pg02_ AM335X Section 1  (U10.C11), Pg12_USB_UART (J5.1)
JTAG_TRSTn: Pg02_ AM335X Section 1  (U10.B10), Pg12_USB_UART (J5.2 R16.1)
LCD_DE: Pg03_ AM335X Section 2  (U10.R6), Pg08_HDMI (J6.1)
LCD_HSYNC: Pg03_ AM335X Section 2  (U10.R5), Pg08_HDMI (J6.10)
LCD_PCLK: Pg03_ AM335X Section 2  (U10.V5), Pg08_HDMI (J6.33)
LCD_VSYNC: Pg03_ AM335X Section 2  (U10.U5), Pg08_HDMI (J6.34)
NetJ6_17: Pg03_ AM335X Section 2  (U10.A13), Pg08_HDMI (J6.17)
NetJ6_21: Pg03_ AM335X Section 2  (U10.C12), Pg08_HDMI (J6.21)
NetJ6_22: Pg03_ AM335X Section 2  (U10.B13), Pg08_HDMI (J6.22)
PMIC_INT1_GPIO: Pg03_ AM335X Section 2  (U10.F16), Pg05_ Platform_Power (R109.2)
PMIC_RESETOUTn: Pg02_ AM335X Section 1  (R114.2 U10.B15), Pg05_ Platform_Power (U12.40)
PWM0: Pg03_ AM335X Section 2  (R12.1 U10.C18), Pg12_USB_UART (J5.37)
PWR_SMPS1_FB: Pg04_ AM335X Section 3  (R96.2), Pg05_ Platform_Power (R65.2 U12.32)
RTC_SQW: Pg06_ SysBoot_LEDS_Mech (R1871.2 U20.7), Pg15_FPGA_5CGX (U19.G22)
SCL: Pg03_ AM335X Section 2  (U10.D15), Pg06_ SysBoot_LEDS_Mech (5 pins), Pg12_USB_UART (J5.28), Pg16_PSU (U30.5 U37.5)
SCL2: Pg03_ AM335X Section 2  (U10.D17), Pg13_FPGA_Connectors (J7.8 J10.26)
SDA: Pg03_ AM335X Section 2  (U10.D16), Pg06_ SysBoot_LEDS_Mech (5 pins), Pg12_USB_UART (J5.29), Pg16_PSU (U30.6 U37.6)
SDA2: Pg03_ AM335X Section 2  (U10.D18), Pg13_FPGA_Connectors (J7.5 J10.22)
TST1: Pg03_ AM335X Section 2  (U10.J15), Pg06_ SysBoot_LEDS_Mech (Q1.G R95.2)
TST2: Pg03_ AM335X Section 2  (U10.H16), Pg11_ USB1 (R92.1 U26.5)
TST5: Pg02_ AM335X Section 1  (U10.U18), Pg15_FPGA_5CGX (R72.2 R73.1 U19.K19)
TST6: Pg02_ AM335X Section 1  (U10.R13), Pg08_HDMI (J6.38 R71.2)
USB0_DM: Pg03_ AM335X Section 2  (U10.N18), Pg11_ USB1 (L1.2)
USB0_DP: Pg03_ AM335X Section 2  (U10.N17), Pg11_ USB1 (L1.1)
USB0_ID: Pg03_ AM335X Section 2  (U10.P16), Pg11_ USB1 (J3.4 U1.3)
USB1_DM: Pg03_ AM335X Section 2  (U10.R18), Pg11_ USB1 (L5.2)
USB1_DP: Pg03_ AM335X Section 2  (U10.R17), Pg11_ USB1 (L5.1)
VARTA: Pg05_ Platform_Power (BT1.1 R156.2), Pg06_ SysBoot_LEDS_Mech (U20.3)
VBACKUP: Pg05_ Platform_Power (R60.1 R156.1 U12.27), Pg12_USB_UART (J5.33)
WP_IDEE: Pg06_ SysBoot_LEDS_Mech (R155.1 U28.7), Pg15_FPGA_5CGX (S2.2)